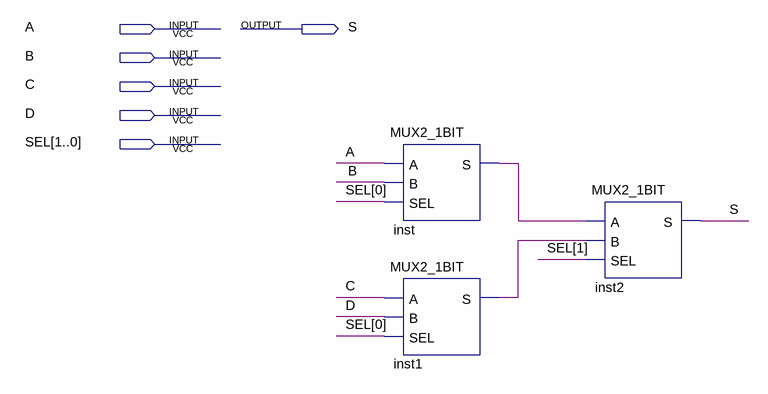
[diagram p0: schematic sheet]
// Quartus schematic MUX4_1BIT.bdf as structural Verilog: 3 symbols, 6 pins
module MUX4_1BIT (
  input  A,
  input  B,
  input  C,
  input  D,
  input  [1:0] SEL,
  output S
);

  wire inst1_s, inst_s;

  MUX2_1BIT inst (.A(A), .B(B), .SEL(SEL[0]), .S(inst_s));
  MUX2_1BIT inst1 (.A(C), .B(D), .SEL(SEL[0]), .S(inst1_s));
  MUX2_1BIT inst2 (.A(inst_s), .B(inst1_s), .SEL(SEL[1]), .S(S));
endmodule
